# Altium project Capybara.PrjPcb (part 2 of 3)

## Sheet Power.SchDoc
size Letter; SheetNumber: 8; PageSetup: Record=PageOptions|CenterHorizontal=True|CenterVertical=True|PrintScale=0.98|XCorrection=1.00|YCorrection=1.00|PrintKind=0|BorderSize=5000000|LeftOffset=0|BottomOffset=0|Orientation=2|PaperLength=1000|PaperWidth=1000|Scale=100|PaperSource=7|PrintQuality=-3|MediaType=1|DitherType=10|PrintScaleMode=1|PaperKind=Letter|PaperIndex=1
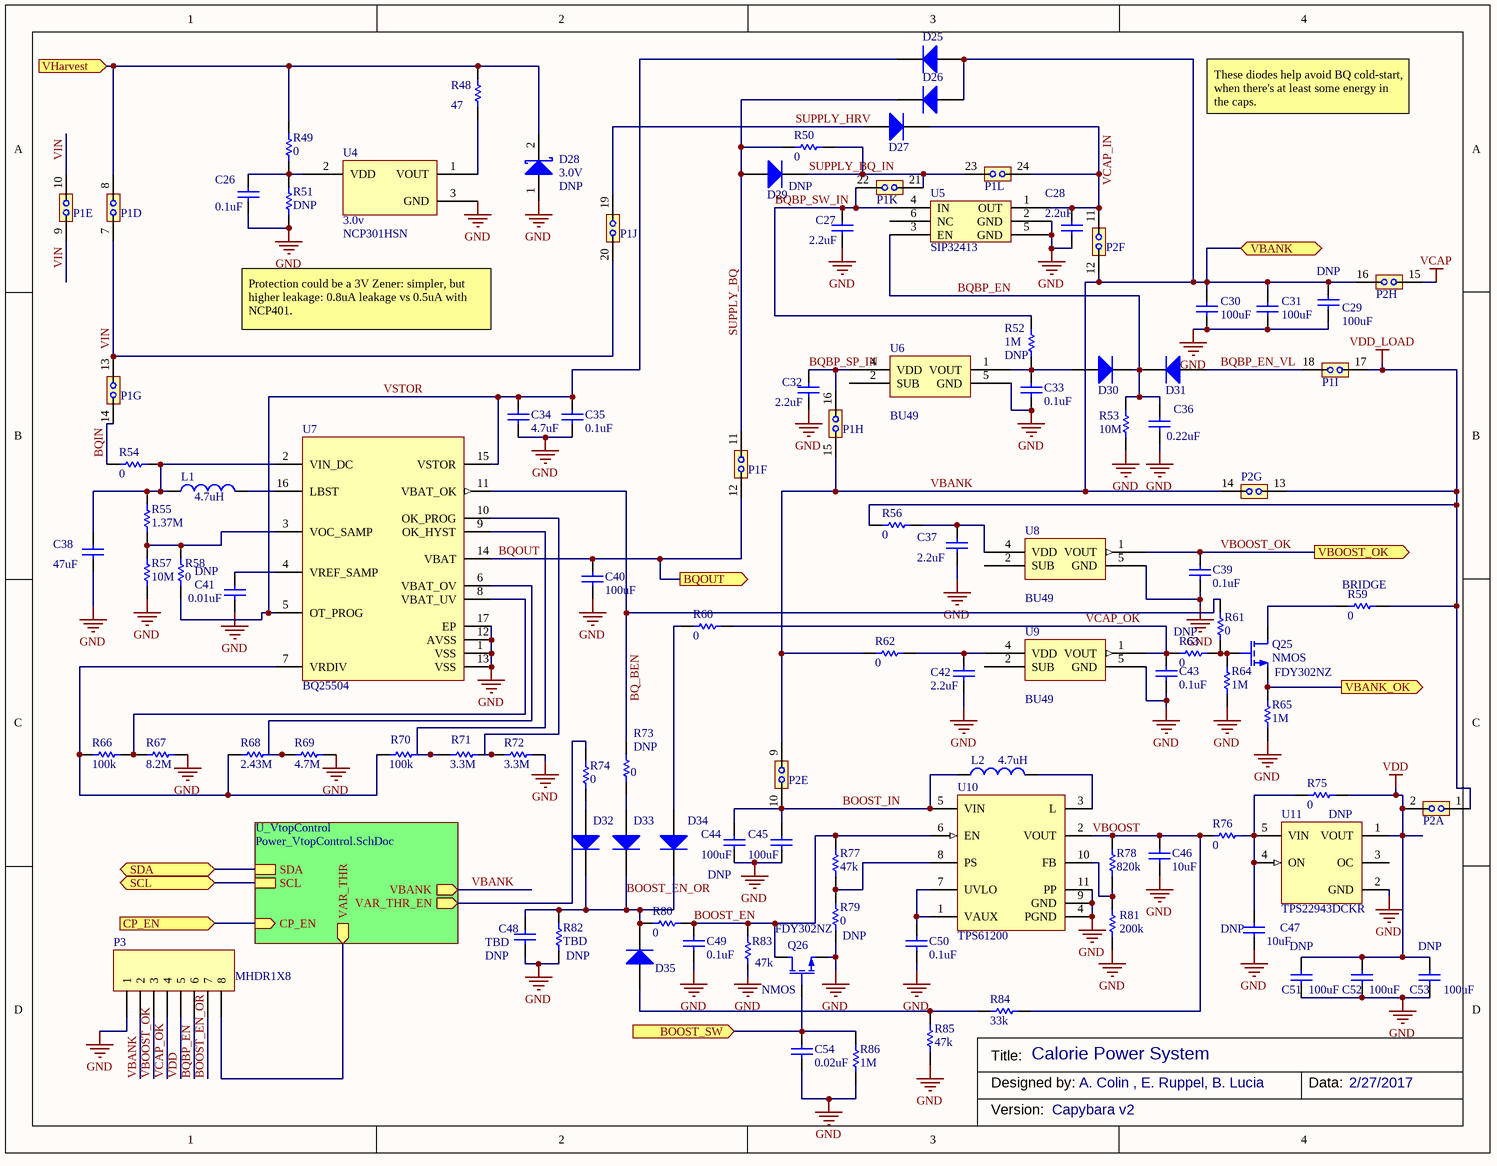
[diagram p6: Power.SchDoc]

### Parts
C26  value 0.1uF  [0603]  (hidden comment: Cap)
C27  value 2.2uF  [0603]  (hidden comment: Cap)
C28  value 2.2uF  [0603]  (hidden comment: Cap)
C29  value 100uF  Note: DNP  [0805]  (hidden comment: Cap)
C30  value 100uF  [0805]  (hidden comment: Cap)
C31  value 100uF  [0805]  (hidden comment: Cap)
C32  value 2.2uF  [0603]  (hidden comment: Cap)
C33  value 0.1uF  [0603]  (hidden comment: Cap)
C34  value 4.7uF  [0603]  (hidden comment: Cap)
C35  value 0.1uF  [0603]  (hidden comment: Cap)
C36  value 0.22uF  [0603]  (hidden comment: Cap)
C37  value 2.2uF  [0603]  (hidden comment: Cap)
C38  value 47uF  [0603]  (hidden comment: Cap)
C39  value 0.1uF  [0603]  (hidden comment: Cap)
C40  value 100uF  [0805]  (hidden comment: Cap)
C41  value 0.01uF  [0603]  (hidden comment: Cap)
C42  value 2.2uF  [0603]  (hidden comment: Cap)
C43  value 0.1uF  [0603]  (hidden comment: Cap)
C44  value 100uF  Note: DNP  [0805]  (hidden comment: Cap)
C45  value 100uF  [0805]  (hidden comment: Cap)
C46  value 10uF  [0603]  (hidden comment: Cap)
C47  value 10uF  Note: DNP  [0805]  (hidden comment: Cap)
C48  value TBD  Note: DNP  [0603]  (hidden comment: Cap)
C49  value 0.1uF  [0603]  (hidden comment: Cap)
C50  value 0.1uF  [0603]  (hidden comment: Cap)
C51  value 100uF  Note: DNP  [0805]  (hidden comment: Cap)
C52  value 100uF  [0805]  (hidden comment: Cap)
C53  value 100uF  Note: DNP  [0805]  (hidden comment: Cap)
C54  value 0.02uF  [0603]  (hidden comment: Cap)
D25  Diode  [SOD-523]  (value not drawn)
D26  Diode  [SOD-523]  (value not drawn)
D27  Diode  [SOD-523]  (value not drawn)
D28  3.0V  Note: DNP  [DIOD-SOD-123-2_V]
D29  Note: DNP  [SOD-523]  (hidden comment: Diode)
D30  Diode  [SOD-523]  (value not drawn)
D31  Diode  [SOD-523]  (value not drawn)
D32  Diode  [SOD-523]  (value not drawn)
D33  Diode  [SOD-523]  (value not drawn)
D34  Diode  [SOD-523]  (value not drawn)
D35  Diode  [SOD-523]  (value not drawn)
L1  value 4.7uH  [PFL1609]
L2  value 4.7uH  [PFL1609]
P1  JMPHDR_12  [MHDR2X12]  (value not drawn)  (parts D,E,F,G,H,I,J,K,L of 12)
P2  JMPHDR_8  (value not drawn)  (parts A,E,F,G,H of 8)
P3  MHDR1X8  [MHDR1X8]
Q25  NMOS  Manufacturer Part Number: FDY302NZ  [SOT-523-3]
Q26  NMOS  Manufacturer Part Number: FDY302NZ  [SOT-523-3]
R48  value 47  [0603]  (hidden comment: Res)
R49  value 0  [0603]  (hidden comment: Res)
R50  value 0  [0603]  (hidden comment: Res)
R51  value DNP  [0603]  (hidden comment: Res)
R52  value 1M  Note: DNP  [0603]  (hidden comment: Res)
R53  value 10M  [0603]  (hidden comment: Res)
R54  value 0  [0603]  (hidden comment: Res)
R55  value 1.37M  [0603]  (hidden comment: Res)
R56  value 0  [0603]  (hidden comment: Res)
R57  value 10M  [0603]  (hidden comment: Res)
R58  value 0  Note: DNP  [0603]  (hidden comment: Resistor)
R59  value 0  Note: BRIDGE  [0603]  (hidden comment: Res)
R60  value 0  [0603]  (hidden comment: Res)
R61  value 0  [0603]  (hidden comment: Res)
R62  value 0  [0603]  (hidden comment: Res)
R63  value 0  Note: DNP  [0603]  (hidden comment: Res)
R64  value 1M  [0603]  (hidden comment: Res)
R65  value 1M  [0603]  (hidden comment: Res)
R66  value 100k  [0603]  (hidden comment: Res)
R67  value 8.2M  [0603]  (hidden comment: Res)
R68  value 2.43M  [0603]  (hidden comment: Res)
R69  value 4.7M  [0603]  (hidden comment: Res)
R70  value 100k  [0603]  (hidden comment: Res)
R71  value 3.3M  [0603]  (hidden comment: Res)
R72  value 3.3M  [0603]  (hidden comment: Res)
R73  value 0  [0603]  (hidden comment: DNP)
R74  value 0  [0603]  (hidden comment: Res)
R75  value 0  [0603]  (hidden comment: Res)
R76  value 0  [0603]  (hidden comment: Res)
R77  value 47k  [0603]  (hidden comment: Res)
R78  value 820k  [0603]  (hidden comment: Res)
R79  value 0  [0603]  (hidden comment: DNP)
R80  value 0  [0603]  (hidden comment: Res)
R81  value 200k  [0603]  (hidden comment: Res)
R82  value TBD  Note: DNP  [0603]  (hidden comment: Res)
R83  value 47k  [0603]  (hidden comment: Res)
R84  value 33k  [0603]  (hidden comment: Res)
R85  value 47k  [0603]  (hidden comment: Res)
R86  value 1M  [0603]  (hidden comment: Res)
U4  value 3.0v  Name: NCP301HSN  [SOT23-5]  (hidden comment: NCP301)
U5  SIP32413  [SC70-6]
U6  Name: BU49  [SOP4]  (hidden comment: BU48)
U7  BQ25504  [VQFN-16]
U8  BU49  [SOP4]
U9  BU49  [SOP4]
U10  TPS61200  [VSON-10]
U11  TPS22943DCKR  Note: DNP  [SC70-5]

### Sub-sheets
U_VtopControl = Power_VtopControl.SchDoc: SDA, SCL, CP_EN (in), VAR_THR_EN (out), VAR_THR (out), VBANK

### Ports
BOOST_SW (in), BQOUT (out), CP_EN (in), SCL, SDA, VBANK, VBANK_OK (out), VBOOST_OK (out), VHarvest (in)

### Nets
GND: C26.1 C27.1 C28.1 C29.1 C30.1 C31.1 C32.1 C33.1 C34.1 C35.1 C36.1 C37.1 C38.2 C39.1 C40.1 C41.1 C42.1 C43.1 C44.1 C45.1 C46.1 C47.1 C48.2 C49.1 C50.1 C51.1 C52.1 C53.1 C54.1 D28.1(A) P3.1 Q26.2(S) R51.1 R53.1 R57.1 R64.1 R65.1 R67.2 R69.2 R72.2 R79.1 R81.1 R82.1 R83.1 R85.1 R86.1 U4.3(GND) U5.2(GND) U5.5(GND) U6.5(GND) U7.1(VSS) U7.12(AVSS) U7.13(VSS) U7.17(EP) U8.5(GND) U9.5(GND) U10.4(PGND) U10.9(GND) U10.11(PP) U11.2(GND)
VCAP: P2.15
VDD: C51.2 C52.2 C53.2 P2.2 P3.5 R75.2 U11.1(VOUT)
VDD_LOAD: P1.17 P2.1 P2.13 R56.2 R59.2
BOOST_EN: C49.2 Q26.3(D) R77.2 R80.2 R83.2 U10.6(EN)
BOOST_EN_OR: C48.1 D32.2(C) D33.2(C) D34.2(C) D35.2(C) P3.7 R80.1 R82.2
BOOST_IN: C44.2 C45.2 L2.1 P2.10 U10.5(VIN)
BOOST_SW: C54.2 Q26.1(G) R86.2 ; port BOOST_SW
BQ_BEN: R61.2 R73.2 U7.11(VBAT_OK)
BQBP_EN: C36.2 D30.2(C) D31.2(C) P3.6 R53.2 U5.3(EN)
BQBP_EN_VL: D31.1(A) P1.18
BQBP_SP_IN: C32.2 P1.16 U6.4(VDD)
BQBP_SW_IN: C27.2 P1.22 R52.2 U5.4(IN)
BQIN: P1.14 R54.1
BQOUT: C40.2 P1.12 U7.14(VBAT) ; port BQOUT
CP_EN: port CP_EN, sheet U_VtopControl/CP_EN
SCL: port SCL, sheet U_VtopControl/SCL
SDA: port SDA, sheet U_VtopControl/SDA
SUPPLY_BQ: D26.2(C) D29.1(A) P1.11 R50.1
SUPPLY_BQ_IN: D29.2(C) P1.21 P1.23 R50.2
SUPPLY_HRV: D27.1(A) P1.19
VAR_THR: P3.8 ; sheet U_VtopControl/VAR_THR
VAR_THR_EN: R74.2 ; sheet U_VtopControl/VAR_THR_EN
VBANK: C29.2 C30.2 C31.2 D25.1(A) D26.1(A) P1.15 P2.9 P2.12 P2.14 P2.16 P3.2 R62.1 ; port VBANK, sheet U_VtopControl/VBANK
VBANK_OK: Q25.2(S) R65.2 ; port VBANK_OK
VBOOST: C46.2 R76.1 R78.2 R84.2 U10.2(VOUT)
VBOOST_OK: C39.2 P3.3 U8.1(VOUT) ; port VBOOST_OK
VCAP_IN: C28.2 D27.2(C) P1.24 P2.11 U5.1(OUT)
VCAP_OK: C43.2 P3.4 R60.2 R63.1 U9.1(VOUT)
VHarvest: D28.2(K) P1.8 R48.1 R49.2 ; port VHarvest
VIN: P1.7 P1.9 P1.10 P1.13 P1.20
VSTOR: C34.2 C35.2 D25.2(C) R58.1 U7.5(OT_PROG) U7.15(VSTOR)
NetC26_2: C26.2 R49.1 R51.2 U4.2(VDD)
NetC33_2: C33.2 D30.1(A) R52.1 U6.1(VOUT)
NetC37_2: C37.2 R56.1 U8.4(VDD)
NetC38_1: C38.1 L1.1 R54.2 R55.2 U7.2(VIN_DC)
NetC41_2: C41.2 U7.4(VREF_SAMP)
NetC42_2: C42.2 R62.2 U9.4(VDD)
NetC47_2: C47.2 R75.1 R76.2 U11.4(ON) U11.5(VIN)
NetC50_2: C50.2 U10.1(VAUX) U10.7(UVLO)
NetD32_1: D32.1(A) R74.1
NetD33_1: D33.1(A) R73.1
NetD34_1: D34.1(A) R60.1
NetD35_1: D35.1(A) R84.1 R85.2
NetL1_2: L1.2 U7.16(LBST)
NetL2_2: L2.2 U10.3(L)
NetQ25_1: Q25.1(G) R61.1 R63.2 R64.2
NetQ25_3: Q25.3(D) R59.1
NetR48_2: R48.2 U4.1(VOUT)
NetR55_1: R55.1 R57.2 R58.2 U7.3(VOC_SAMP)
NetR66_1: R66.1 R68.1 R70.1 U7.7(VRDIV)
NetR66_2: R66.2 R67.1 U7.8(VBAT_UV)
NetR68_2: R68.2 R69.1 U7.6(VBAT_OV)
NetR70_2: R70.2 R71.1 U7.9(OK_HYST)
NetR71_2: R71.2 R72.1 U7.10(OK_PROG)
NetR77_1: R77.1 R79.2 U10.8(PS)
NetR78_1: R78.1 R81.2 U10.10(FB)

Not connected (* = marked no-connect by the designer): U5 6(NC); U6 2(SUB); U8 2(SUB); U9 2(SUB); U11 3(OC)

### Notes on the sheet
- These diodes help avoid BQ cold-start, when there's at least some energy in the caps.
- Protection could be a 3V Zener: simpler, but higher leakage: 0.8uA leakage vs 0.5uA with NCP401.
- Title:
- Designed by:
- (near R84) Calorie Power System
- A. Colin , E. Ruppel, B. Lucia
- Data:
- 2/27/2017
- Version:
- Capybara v2

### Library data of the parts
C26 C33 C35 C39 C43 C49 C50 = Cap: as C115 on sheet CapBank_Introspection; Note: *; Rating: *; Distributor Part Number: 490-1532-1-ND; Distributor: Digi-Key
  C26 C33 C35 C39 C43: Digi-Key Part Number: *
C27 C28 C32 C37 C42 = Cap: as C55 on sheet Sensors; Note: *; Rating: *; Distributor Part Number: 490-3296-1-ND; Distributor: Digi-Key
C29 = Cap: Ceramic Capacitor (Surface Mount); Manufacturer: Murata Electronics North America; Manufacturer Part Number: GRM21BR60J107ME15L; Rating: 6.3V; PurchaseNote: 47uF 587-3266-1-ND; Distributor Part Number: 490-13981-1-ND; Distributor: Digi-Key
C30 C31 = Cap: Ceramic Capacitor (Surface Mount); Manufacturer: Murata Electronics North America; Manufacturer Part Number: GRM21BR60G107ME15L; Rating: 6.3V; PurchaseNote: 47uF 587-3266-1-ND; Distributor: Mouser; Mouser Part Number: 81-GRM21BR60G107ME5L
C34 = Cap: Ceramic Capacitor (Surface Mount); Manufacturer: Samsung Electro-Mechanics; Manufacturer Part Number: CL10B475KQ8NQNC; Digi-Key Part Number: *; Note: *; Rating: *; Distributor Part Number: 1276-2087-1-ND; Distributor: Digi-Key
C36 = Cap: Ceramic Capacitor (Surface Mount); Manufacturer: Murata Electronics North America; Manufacturer Part Number: GRM188R71E224KA88D; Note: *; Rating: *; Distributor Part Number: 490-3290-1-ND; Distributor: Digi-Key
C38 = Cap: Ceramic Capacitor (Surface Mount); Manufacturer: Samsung Electro-Mechanics; Manufacturer Part Number: CL10A476MR8NZNE; Note: *; Distributor Part Number: 1276-6528-1-ND; Distributor: Digi-Key
C40 = Cap: Ceramic Capacitor (Surface Mount); Manufacturer: Murata Electronics North America; Manufacturer Part Number: GRM21BR60G107ME15L; Rating: 6.3V; Digi-Key Part Number: *; Note: *; Distributor: Mouser; Mouser Part Number: 81-GRM21BR60G107ME5L
C41 = Cap: Ceramic Capacitor (Surface Mount); Manufacturer: Murata Electronics North America; Manufacturer Part Number: GRM155R71E103JA01J; Rating: X7R, 10%; Note: *; Distributor Part Number: 490-6340-1-ND; Distributor: Digi-Key
C44 C45 = Cap: Ceramic Capacitor (Surface Mount); Manufacturer: Murata Electronics North America; Manufacturer Part Number: GRM21BR60G107ME15L; PurchaseNote: or CL10A476MR8NZNE 4.0V 0.8mm; Rating: *; Distributor: Mouser; Mouser Part Number: 81-GRM21BR60G107ME5L
  C45: Note: *
C46 = Cap: Ceramic Capacitor (Surface Mount); Manufacturer: Murata Electronics North America; Manufacturer Part Number: GRM188R60J106ME47D; Note: *; Rating: *; Distributor Part Number: 490-3896-1-ND; Distributor: Digi-Key
C47 = Cap: Ceramic Capacitor (Surface Mount); Manufacturer: Murata Electronics North America; Manufacturer Part Number: GRM21BR61E106MA73L; Rating: *; Distributor Part Number: 490-10748-1-ND; Distributor: Digi-Key
C48 = Cap: Ceramic Capacitor (Surface Mount); Manufacturer: Generic Ceramic Chip Cap (TBD); Digi-Key Part Number: *; Manufacturer Part Number: *; Rating: *; Distributor Part Number: *; Distributor: *
C51-C53 = Cap: Ceramic Capacitor (Surface Mount); Manufacturer: Murata Electronics North America; Manufacturer Part Number: GRM21BR60G107ME15L; Rating: *; Distributor: Mouser; Mouser Part Number: 81-GRM21BR60G107ME5L
  C52: Note: *
C54 = Cap: Ceramic Capacitor (Surface Mount); Manufacturer: Samsung Electro-Mechanics; Manufacturer Part Number: CL10B203KB8NNNC; Digi-Key Part Number: *; Note: *; Rating: *; Distributor Part Number: 1276-1984-1-ND; Distributor: Digi-Key
D25-D27 D29-D35 = Diode: General Purpose Diode; Manufacturer: Vishay Semiconductor; Manufacturer Part Number: BAS40-02V-V-G-08; Digi-Key Part Number: BAS40-02V-V-G-08GICT-ND; Value: *; Rating: *; Distributor Part Number: 78-BAS40-02V-V-G-08; Distributor: Mouser; Mouser Part Number: 78-BAS40-02V-V-G-08
  D27 D30-D35: Note: *
D28 = CMP-0303-00003-1: 1.0 A Surface Mount Schottky Barrier Rectifier, 40 V, -65 to 125 degC, 2-Pin SOD-123 Package, RoHS, Tape and Reel; Manufacturer Part Number: MMSZ4683-TP; Manufacturer: Micro Commercial Co; PackageDescription: 2-Pin SOD-123, Body 2.7 x 1.55 mm, Pitch 3.7 mm; PackageReference: SOD-123-2; Digi-Key Part Number: MMSZ4683-TPMSCT-ND
L1 L2 = Inductor: Manufacturer: Coilcraft; Manufacturer Part Number: PFL1609-472MEU; PackageReference: PFL1609; Distributor: Mouser; Distributor Part Number: 994-PFL1609-472MEU
P2 = JMPHDR_8: Manufacturer: Sullins Connector Solutions; Manufacturer Part Number: GRPB082VWVN-RC; Digi-Key Part Number: S9015E-08-ND; Distributor: Digikey; Distributor Part Number: S9015E-08-ND
P3 = MHDR1X8: Header, 8-Pin; Manufacturer: Harwin Inc.; Manufacturer Part Number: M52-5000845; LatestRevisionDate: 17-Jul-2002; LatestRevisionNote: Re-released for DXP Platform.; Publisher: Altium Limited; Digi-Key Part Number: 952-3361-ND; Distributor: Mouser; Distributor Part Number: 855-M52-5000845; Mouser Part Number: 855-M52-5000845
Q25 Q26 = MOSFET-N: N-Channel MOSFET; Manufacturer: Fairchild; Note: *; Rating: *; Value: NMOS; Distributor: Digi-Key; Distributor Part Number: FDY302NZCT-ND
  Q26: Digi-Key Part Number: *
R48 = Res: Chip Resistor (Surface Mount); Manufacturer: Yageo; Manufacturer Part Number: RC0603JR-0747RL; Digi-Key Part Number: *; Rating: *; Note: *; Distributor: Digi-Key; Distributor Part Number: 311-47GRCT-ND
R49 R50 R54 R56 R58-R63 R73-R76 R79 R80 = Res: as R9 on sheet CapBank; Rating: *; Distributor: Digi-Key; Distributor Part Number: 311-0.0GRCT-ND
  R49 R54 R56 R60-R62 R80: Note: *
  R73: Digi-Key Part Number: *; Note: DNP
  R74 R76: Digi-Key Part Number: *; Note: *
  R75: Digi-Key Part Number: *
  R79: Note: DNP
R51 = Res: Chip Resistor (Surface Mount); Manufacturer: Yageo; Digi-Key Part Number: *; Rating: *; Note: *; Distributor: Digi-Key
R52 R64 R65 = Res: Chip Resistor (Surface Mount); Manufacturer: Yageo; Manufacturer Part Number: RC0603FR-071ML; Rating: *; Distributor: Digi-Key; Distributor Part Number: 311-1.00MHRCT-ND
  R52: Digi-Key Part Number: *
  R64 R65: Note: *
R53 R57 R86 = Res: as R89 on sheet Sensors; Rating: *; Distributor: Digi-Key; Distributor Part Number: 311-10MGRCT-ND
  R57: Note: *
  R86: Digi-Key Part Number: *; Note: *
R55 = Res: Chip Resistor (Surface Mount); Manufacturer: Vishay Dale; Manufacturer Part Number: CRCW04021M37FKED; Rating: *; Note: *; Distributor: Digi-Key; Distributor Part Number: 541-1.37MLCT-ND
R66 = Res: Chip Resistor (Surface Mount); Manufacturer: Yageo; Manufacturer Part Number: RT0603FRE07100KL; Rating: 1%; Note: *; Distributor: Digi-Key; Distributor Part Number: YAG2319CT-ND
R67 = Res: Chip Resistor (Surface Mount); Manufacturer: Vishay Dale; Manufacturer Part Number: CRCW06038M20FKEA; Rating: 1%; Note: *; Distributor: Digi-Key; Distributor Part Number: 541-8.20MHCT-ND
R68 = Res: Chip Resistor (Surface Mount); Manufacturer: Vishay; Manufacturer Part Number: CRCW06032M43FKEA; Note: *; Distributor: Mouser; Distributor Part Number: 71-CRCW0603-2.43M-E3; Mouser Part Number: 71-CRCW0603-2.43M-E3
R69 = Res: Chip Resistor (Surface Mount); Manufacturer: Generic Chip Res (TBD); Manufacturer Part Number: RC0603FR-074M7L; Rating: 1%; Note: *; Distributor: Digi-Key; Distributor Part Number: 311-4.70MHRCT-ND
R70 R71 = Res: Chip Resistor (Surface Mount); Manufacturer: Yageo; Manufacturer Part Number: RC0603FR-071M6L; Rating: 1%; Distributor: Digi-Key; Distributor Part Number: YAG3327CT-ND
R72 = Res: Chip Resistor (Surface Mount); Manufacturer: Vishay Dale; Manufacturer Part Number: CRCW06033M30FKEA; Rating: 1%; Distributor: Digi-Key; Distributor Part Number: 541-3.30MHCT-ND
R77 R83 R85 = Res: as R1 on sheet CapBank; Rating: *; Note: *; Distributor: Digi-Key; Distributor Part Number: 311-47KDCT-ND
  R85: Digi-Key Part Number: *
R78 = Res: Chip Resistor (Surface Mount); Manufacturer: Yageo; Manufacturer Part Number: RC0603FR-07820KL; Rating: *; Distributor: Digi-Key; Distributor Part Number: 311-820KHRCT-ND
R81 = Res: Chip Resistor (Surface Mount); Manufacturer: Yageo; Manufacturer Part Number: RC0603FR-07200KL; Rating: *; Note: *; Distributor: Digi-Key; Distributor Part Number: 311-200KHRCT-ND
R82 = Res: as R132 on sheet CapBank; Manufacturer Part Number: *; Digi-Key Part Number: *; Rating: *
R84 = Res: Chip Resistor (Surface Mount); Manufacturer: Yageo; Manufacturer Part Number: RT0603DRE0733KL; Digi-Key Part Number: *; Rating: *; Note: *; Distributor: Digi-Key; Distributor Part Number: 311-2543-1-ND
U4 = NCP301: IC DETECTOR OPEN-DRAIN; Manufacturer: ON Semiconductor; Manufacturer Part Number: NCP301HSN30T1G; Digi-Key Part Number: NCP301HSN30T1GOSCT-ND; Distributor: Mouser; Distributor Part Number: 863-NCP301HSN30T1G; Mouser Part Number: 863-NCP301HSN30T1G
U5 = SIP32431: as U12 on sheet Sensors; Digi-Key Part Number: SIP32431DR3-T1GE3CT-ND; Distributor: Mouser; Distributor Part Number: 781-SIP32431DR3-GE3; Mouser Part Number: 781-SIP32431DR3-GE3
U6 = BU48: IC DETECTOR OPEN-DRAIN; pin to pad: 2>3 4>2 5>4; Manufacturer: ROHM Semiconductor; Manufacturer Part Number: BU4917F-TR; Digi-Key Part Number: BU4917F-TR-ND; Distributor: Quest Components; Distributor Part Number: BU4917F-TR; Mouser Part Number: 755-BU4917F-TR
U7 = BQ25504: Manufacturer: BQ25504RGTT; Manufacturer Part Number: Texas Instruments; Digi-Key Part Number: 296-29741-1-ND; Distributor: Mouser; Distributor Part Number: 595-BQ25504RGTR; Mouser Part Number: 595-BQ25504RGTR
U8 U9 = BU49: IC DETECTOR CMOS; pin to pad: 2>3 4>2 5>4; Manufacturer: ROHM Semiconductor; Manufacturer Part Number: BU4924F-TR; Name: BU49; Digi-Key Part Number: BU4924F-TR-ND; Distributor: Quest Components; Distributor Part Number: BU4924F-TR; Mouser Part Number: 755-BU4924F-TR
U10 = TPS61200: Manufacturer: Texas Instruments; Manufacturer Part Number: TPS61200DRCR; Distributor: Digi-Key; Distributor Part Number: 296-27017-1-ND; Digi-Key Part Number: 296-27017-1-ND; Mouser Part Number: 595-TPS61200DRCR
U11 = CMP-0329-00079-2: Low-Input Voltage 40 mA Current Limited Load Switch, 400 mOhms rDS(On), -40 to 85 degC, 5-pin SC70 (DCK), Green (RoHS & no Sb/Br); Manufacturer: Texas Instruments; SubFamily: Current Limited Switch; Vin(Min)(V): 1.62; Number of FETs: 1; Adjustable Current Limit(Min)(A): 0.04; Enable/Shutdown: Active High; Vin(Max)(V): 5.5; rDS(on) per FET(Typ)(mOhms): 400; Iq(Typ)(uA): 40; PackageReference: DCK0005A; PackageDescription: 5-Pin Plastic Small-Outline Package, 2 x 1.3 mm Body, 0.65 mm Pitch, 2.1 mm Lead Span; DatasheetVersion: SLVS832C; ComponentLink1URL: http://www.ti.com/general/docs/lit/getliterature.tsp?genericPartNumber=TPS22943&fileType=pdf; Mounting Technology: Surface Mount; Code_JEDEC: MO-203-AA; PartNumber: TPS22943DCKR; PackageVersion: revG, Jan-2007; Eco-Plan: Green (RoHS & no Sb/Br); ComponentLink1Description: Datasheet; Distributor: Digi-Key; Distributor Part Number: 296-25316-1-ND; Manufacturer Part Number: TPS22943DCKR; Digi-Key Part Number: 296-25316-1-ND; Mouser Part Number: 595-TPS22943DCKR

## Sheet Power_VtopControl.SchDoc
size A; SheetNumber: 9
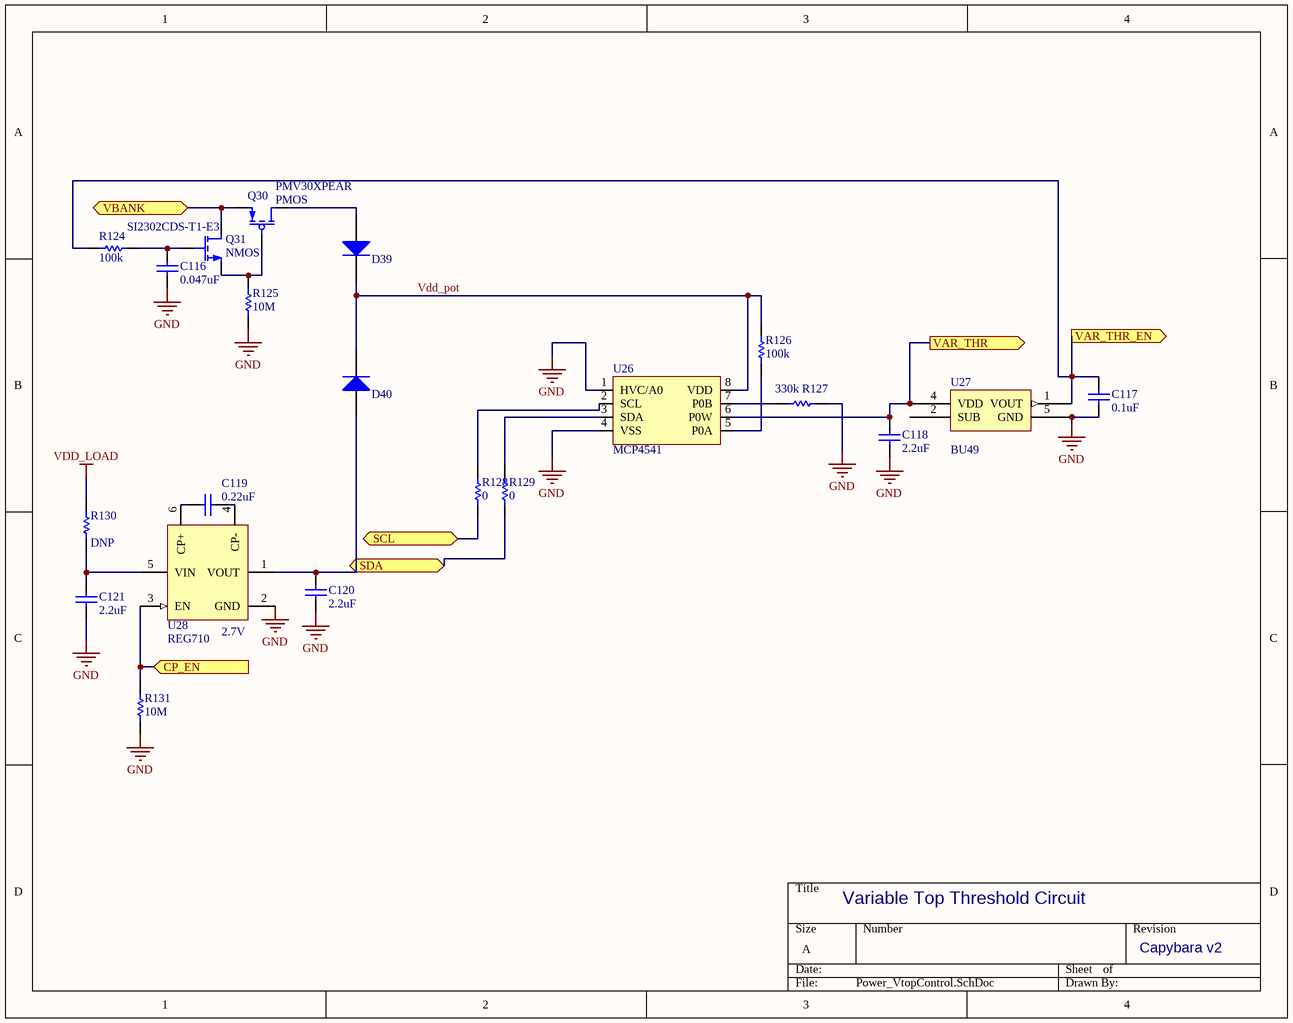
[diagram p7: Power_VtopControl.SchDoc]

### Parts
C116  value 0.047uF  [0603]  (hidden comment: Cap)
C117  value 0.1uF  [0603]  (hidden comment: Cap)
C118  value 2.2uF  [0603]  (hidden comment: Cap)
C119  value 0.22uF  [0603]  (hidden comment: Cap)
C120  value 2.2uF  [0603]  (hidden comment: Cap)
C121  value 2.2uF  [0603]  (hidden comment: Cap)
D39  Diode  [SOD-523]  (value not drawn)
D40  Diode  [SOD-523]  (value not drawn)
Q30  PMOS  Manufacturer Part Number: PMV30XPEAR  [SOT23 - N]
Q31  NMOS  Manufacturer Part Number: SI2302CDS-T1-E3  [SOT23 - N]
R124  value 100k  [0603]  (hidden comment: Res)
R125  value 10M  [0603]  (hidden comment: Res)
R126  value 100k  [0603]  (hidden comment: Res)
R127  value 330k  [0603]  (hidden comment: Resistor)
R128  value 0  [0603]  (hidden comment: Resistor)
R129  value 0  [0603]  (hidden comment: Resistor)
R130  value DNP  [0603]  (hidden comment: Res)
R131  value 10M  [0603]  (hidden comment: Res)
U26  MCP4541  [MSOP8]
U27  BU49  [SOP4]
U28  REG710  value 2.7V  [SOT23-6]

### Ports
CP_EN (in), SCL, SDA, VAR_THR (out), VAR_THR_EN (out), VBANK

### Nets
GND: C116.1 C117.1 C118.1 C120.1 C121.1 R125.1 R127.1 R131.1 U26.1(HVC/A0) U26.4(VSS) U27.5(GND) U28.2(GND)
VDD_LOAD: R130.1
CP_EN: R131.2 U28.3(EN) ; port CP_EN
SCL: R128.1 ; port SCL
SDA: R129.1 ; port SDA
VAR_THR: C118.2 U26.6(P0W) U27.4(VDD) ; port VAR_THR
VAR_THR_EN: C117.2 R124.1 U27.1(VOUT) ; port VAR_THR_EN
VBANK: Q30.2(S) Q31.3(D) ; port VBANK
Vdd_pot: D39.2(C) D40.2(C) R126.2 U26.8(VDD)
NetC116_2: C116.2 Q31.1(G) R124.2
NetC119_1: C119.1 U28.4(CP-)
NetC119_2: C119.2 U28.6(CP+)
NetC120_2: C120.2 D40.1(A) U28.1(VOUT)
NetC121_2: C121.2 R130.2 U28.5(VIN)
NetD39_1: D39.1(A) Q30.3(D)
NetQ30_1: Q30.1(G) Q31.2(S) R125.2
NetR126_1: R126.1 U26.5(P0A)
NetR127_2: R127.2 U26.7(P0B)
NetR128_2: R128.2 U26.2(SCL)
NetR129_2: R129.2 U26.3(SDA)

Not connected (* = marked no-connect by the designer): U27 2(SUB)

### Notes on the sheet
- Variable Top Threshold Circuit
- Capybara v2

### Library data of the parts
C116 = Cap: Ceramic Capacitor (Surface Mount); Manufacturer: Murata Electronics North America; Manufacturer Part Number: GRM188R71H473KA61D; Digi-Key Part Number: *; Note: *; Rating: *; Distributor Part Number: 490-3287-1-ND; Distributor: Digi-Key
C117 = Cap: as C115 on sheet CapBank_Introspection; Digi-Key Part Number: *; Note: *; Rating: *; Distributor Part Number: 490-1532-1-ND; Distributor: Digi-Key
C118 C120 C121 = Cap: as C55 on sheet Sensors; Digi-Key Part Number: *; Note: *; Rating: *; Distributor Part Number: 490-3296-1-ND; Distributor: Digi-Key
C119 = Cap: as C36 on sheet Power; Digi-Key Part Number: *; Note: *; Rating: *; Distributor Part Number: 490-3290-1-ND; Distributor: Digi-Key
D39 D40 = Diode: as D25 on sheet Power; Digi-Key Part Number: BAS40-02V-V-G-08GICT-ND; Value: *; Rating: *; Note: *; Distributor Part Number: 78-BAS40-02V-V-G-08; Distributor: Mouser; Mouser Part Number: 78-BAS40-02V-V-G-08
Q30 = MOSFET-P: P-Channel MOSFET; Manufacturer: Nexperia; Digi-Key Part Number: 1727-2531-1-ND; Note: *; Rating: *; Distributor: Mouser; Distributor Part Number: 771-PMV30XPEAR; Value: PMOS; Mouser Part Number: 771-PMV30XPEAR
Q31 = MOSFET-N: N-Channel MOSFET; Manufacturer: Vishay Siliconix; Digi-Key Part Number: SI2302CDS-T1-E3CT-ND; Note: *; Rating: *; Value: NMOS; Distributor: Mouser; Distributor Part Number: 781-SI2302CDS-E3; Mouser Part Number: 781-SI2302CDS-E3
R124 R126 = Res: as R93 on sheet Sensors; Digi-Key Part Number: *; Rating: *; Distributor: Digi-Key; Distributor Part Number: YAG2319CT-ND
  R124: Note: *
R125 R131 = Res: as R89 on sheet Sensors; Digi-Key Part Number: *; Rating: *; Note: *; Distributor: Digi-Key; Distributor Part Number: 311-10MGRCT-ND
R127 = Res: Chip Resistor (Surface Mount); Manufacturer: Yageo; Manufacturer Part Number: RC0603FR-07330KL; Rating: *; Distributor: Digi-Key; Distributor Part Number: 311-330KHRCT-ND
R128 R129 = Res: as R9 on sheet CapBank; Rating: *; Distributor: Digi-Key; Distributor Part Number: 311-0.0GRCT-ND
R130 = Res: as R132 on sheet CapBank; Manufacturer Part Number: *; Digi-Key Part Number: *; Rating: *
U26 = MCP4541: Manufacturer: Microchip; Manufacturer Part Number: MCP4541T-104E/MS; Digi-Key Part Number: MCP4541-104E/MS-ND; Distributor: Mouser; Distributor Part Number: 579-MCP4541-104E/MS; Mouser Part Number: 579-MCP4541-104E/MS
U27 = BU49: IC DETECTOR CMOS; pin to pad: 2>3 4>2 5>4; Manufacturer: ROHM Semiconductor; Manufacturer Part Number: BU4917F-TR; Name: BU49; Digi-Key Part Number: BU4917F-TR-ND; Distributor: Quest Components; Distributor Part Number: BU4917F-TR; Mouser Part Number: 755-BU4917F-TR
U28 = REG710: Manufacturer: Texas Instruments; Manufacturer Part Number: REG710NA-2.7/250; Digi-Key Part Number: 296-12134-1-ND; Distributor: Mouser; Distributor Part Number: 595-REG710NA-2.7/250; Mouser Part Number: 595-REG710NA-2.7/250

## Sheet Radio.SchDoc
size Letter; SheetNumber: 10
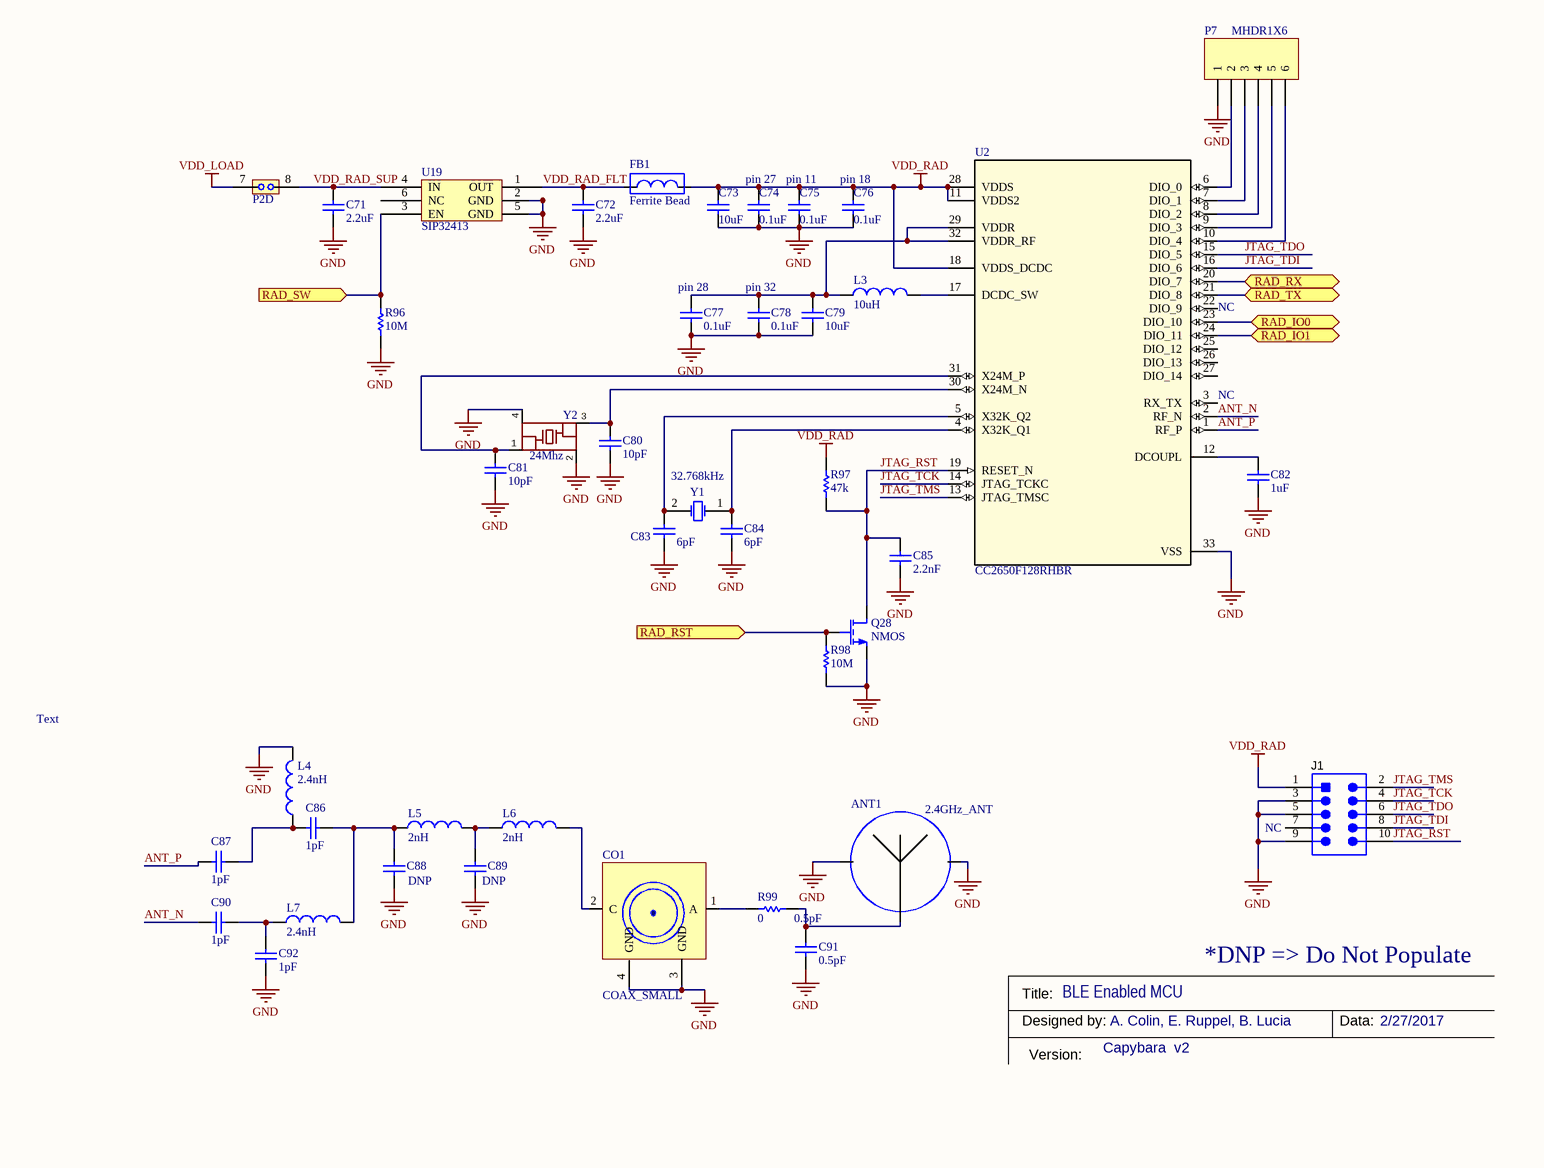
[diagram p8: Radio.SchDoc, bottom left]

### Parts
ANT1  2.4GHz_ANT  [IIF_INV]  (net tie, no BOM)
C71  value 2.2uF  [0603]  (hidden comment: Cap)
C72  value 2.2uF  [0603]  (hidden comment: Cap)
C73  value 10uF  [0603]  (hidden comment: Cap)
C74  value 0.1uF  [0603]  (hidden comment: Cap)
C75  value 0.1uF  [0603]  (hidden comment: Cap)
C76  value 0.1uF  [0603]  (hidden comment: Cap)
C77  value 0.1uF  [0603]  (hidden comment: Cap)
C78  value 0.1uF  [0603]  (hidden comment: Cap)
C79  value 10uF  [0603]  (hidden comment: Cap)
C80  value 10pF  [0402]  (hidden comment: Cap)
C81  value 10pF  [0402]  (hidden comment: Cap)
C82  value 1uF  [0603]  (hidden comment: Cap)
C83  value 6pF  [0402]  (hidden comment: Cap)
C84  value 6pF  [0402]  (hidden comment: Cap)
C85  value 2.2nF  [0603]  (hidden comment: Cap)
C86  value 1pF  [0402]  (hidden comment: Cap)
C87  value 1pF  [0402]  (hidden comment: Cap)
C88  Note: DNP  [0402]  (hidden comment: Cap)
C89  Note: DNP  [0402]  (hidden comment: Cap)
C90  value 1pF  [0402]  (hidden comment: Cap)
C91  value 0.5pF  Note: 0.5pF  [0402]  (hidden comment: Cap)
C92  value 1pF  [0402]  (hidden comment: Cap)
CO1  COAX_SMALL  [COAX SMALL_v2]
FB1  Ferrite Bead  [0603]
J1  (no value)  [JTAG_V3]
L3  value 10uH  [0603]  (hidden comment: Ind)
L4  value 2.4nH  [0402]  (hidden comment: Ind)
L5  value 2nH  [0402]  (hidden comment: Ind)
L6  value 2nH  [0402]  (hidden comment: Ind)
L7  value 2.4nH  [0402]  (hidden comment: Ind)
P2  JMPHDR_8  [MHDR2X8]  (value not drawn)  (part D of 8)
P7  MHDR1X6  [MHDR1X6]
Q28  NMOS  [SOT-523-3]
R96  value 10M  [0603]  (hidden comment: Res)
R97  value 47k  [0603]  (hidden comment: Res)
R98  value 10M  [0603]  (hidden comment: Res)
R99  value 0  [0402]  (hidden comment: Res)
U2  CC2650F128RHBR  [RHB0032E_NV]
U19  SIP32413  [SC70-6]
Y1  value 32.768kHz  [XTAL - 2Pin [3.2mm x 1.5mm]]
Y2  value 24Mhz  [XTAL - 4Pin [2.5mm x 2.0mm]]

### Ports
RAD_IO0 (bidir), RAD_IO1 (bidir), RAD_RST (in), RAD_RX (bidir), RAD_SW (in), RAD_TX (bidir)

### Nets
GND: ANT1.2(GND) ANT1.3(GND) C71.1 C72.1 C73.1 C74.1 C75.1 C76.1 C77.1 C78.1 C79.1 C80.1 C81.2 C82.1 C83.1 C84.1 C85.2 C88.1 C89.1 C91.1 C92.1 CO1.3(GND) CO1.4(GND) J1.3 J1.5 J1.9 L4.2 P7.1 Q28.2(S) R96.1 R98.1 U2.33(VSS) U19.2(GND) U19.5(GND) Y2.2(GROUND2) Y2.4(GROUND4)
VDD_LOAD: P2.7
VDD_RAD: C73.2 C74.2 C75.2 C76.2 FB1.2 J1.1 R97.2 U2.11(VDDS2) U2.18(VDDS_DCDC) U2.28(VDDS)
ANT_N: C90.2 U2.2(RF_N)
ANT_P: C87.2 U2.1(RF_P)
JTAG_RST: C85.1 J1.10 Q28.3(D) R97.1 U2.19(RESET_N)
JTAG_TCK: J1.4 U2.14(JTAG_TCKC)
JTAG_TDI: J1.8 U2.16(DIO_6)
JTAG_TDO: J1.6 U2.15(DIO_5)
JTAG_TMS: J1.2 U2.13(JTAG_TMSC)
RAD_IO0: U2.23(DIO_10) ; port RAD_IO0
RAD_IO1: U2.24(DIO_11) ; port RAD_IO1
RAD_RST: Q28.1(G) R98.2 ; port RAD_RST
RAD_RX: U2.20(DIO_7) ; port RAD_RX
RAD_SW: R96.2 U19.3(EN) ; port RAD_SW
RAD_TX: U2.21(DIO_8) ; port RAD_TX
VDD_RAD_FLT: C72.2 FB1.1 U19.1(OUT)
VDD_RAD_SUP: C71.2 P2.8 U19.4(IN)
NetANT1_1: ANT1.1(ANT) C91.2 R99.2
NetC77_2: C77.2 C78.2 C79.2 L3.1 U2.29(VDDR) U2.32(VDDR_RF)
NetC80_2: C80.2 U2.30(X24M_N) Y2.3(P3)
NetC81_1: C81.1 U2.31(X24M_P) Y2.1(P$1)
NetC82_2: C82.2 U2.12(DCOUPL)
NetC83_2: C83.2 U2.5(X32K_Q2) Y1.2(OSC2)
NetC84_2: C84.2 U2.4(X32K_Q1) Y1.1(OSC1)
NetC86_1: C86.1 C88.2 L5.1 L7.2
NetC86_2: C86.2 C87.1 L4.1
NetC89_2: C89.2 L5.2 L6.1
NetC90_1: C90.1 C92.2 L7.1
NetCO1_1: CO1.1(A) R99.1
NetCO1_2: CO1.2(C) L6.2
NetL3_2: L3.2 U2.17(DCDC_SW)
NetP7_2: P7.2 U2.6(DIO_0)
NetP7_3: P7.3 U2.7(DIO_1)
NetP7_4: P7.4 U2.8(DIO_2)
NetP7_5: P7.5 U2.9(DIO_3)
NetP7_6: P7.6 U2.10(DIO_4)

Not connected (* = marked no-connect by the designer): J1 7; U2 3(RX_TX) 22(DIO_9) 25(DIO_12) 26(DIO_13) 27(DIO_14); U19 6(NC)

### Notes on the sheet
- pin 27
- (near C75) pin 11
- (near C76) pin 18
- (near C77) pin 28
- (near C78) pin 32
- (near U2) NC
- Text
- (near J1) NC
- *DNP => Do Not Populate
- Title:
- Designed by:
- BLE Enabled MCU
- A. Colin, E. Ruppel, B. Lucia
- Data:
- 2/27/2017
- Version:
- Capybara  v2

### Library data of the parts
C71 C72 = Cap: Ceramic Capacitor (Surface Mount); Manufacturer: Murata Electronics North America; Manufacturer Part Number: GRM188R61C225KE15D; Digi-Key Part Number: *; Note: *; Rating: *; Distributor Part Number: 490-3296-1-ND; Distributor: Digi-Key
C73 C79 = Cap: Ceramic Capacitor (Surface Mount); Manufacturer: Murata Electronics North America; Manufacturer Part Number: GRM188R60J106ME47D; Digi-Key Part Number: *; Note: *; Rating: *; Distributor Part Number: 490-3896-1-ND; Distributor: Digi-Key
C74-C78 = Cap: Ceramic Capacitor (Surface Mount); Manufacturer: Murata Electronics North America; Manufacturer Part Number: GRM188R71C104KA01D; Digi-Key Part Number: *; Note: *; Rating: *; Distributor Part Number: 490-1532-1-ND; Distributor: Digi-Key
C80 C81 = Cap: Ceramic Capacitor (Surface Mount); Manufacturer: AvX; Manufacturer Part Number: 04025A100MAT2A; Digi-Key Part Number: *; Note: *; Rating: *; Distributor Part Number: 581-04025A100MAT2A; Distributor: Mouser
C82 = Cap: Ceramic Capacitor (Surface Mount); Manufacturer: Murata Electronics North America; Manufacturer Part Number: GRM188R61A105KA61D; Digi-Key Part Number: *; Note: *; Rating: *; Distributor Part Number: 490-1543-1-ND; Distributor: Digi-Key
C83 C84 = Cap: Ceramic Capacitor (Surface Mount); Manufacturer: Murata Electronics North America; Manufacturer Part Number: GRM1555C1H6R0CA01D; Digi-Key Part Number: *; Rating: *; Distributor Part Number: 490-8222-1-ND; Distributor: Digi-Key
C85 = Cap: Ceramic Capacitor (Surface Mount); Manufacturer: Murata Electronics North America; Manufacturer Part Number: GRM1885C1H222JA01D; Rating: *; Distributor Part Number: 490-1459-1-ND; Distributor: Digi-Key
C86 C87 C90 C92 = Cap: Ceramic Capacitor (Surface Mount); Manufacturer: Murata Electronics; Manufacturer Part Number: GJM1555C1H1R0BB01D; Note: DNP; Digi-Key Part Number: 712-1266-1-ND; Rating: *; Distributor Part Number: 490-6073-1-ND; Distributor: Digi-Key
C88 C89 = Cap: Ceramic Capacitor (Surface Mount); Manufacturer: Generic Ceramic Chip Cap (TBD); Digi-Key Part Number: *; Manufacturer Part Number: *; Rating: *; Distributor Part Number: *; Distributor: *
C91 = Cap: Ceramic Capacitor (Surface Mount); Manufacturer: Murata Electronics; Digi-Key Part Number: *; Manufacturer Part Number: *; Rating: *; Distributor Part Number: 490-6263-1-nd; Distributor: Digikey
CO1 = COAX_SMALL: ms-156hf; Manufacturer: Hirose Connector; Manufacturer Part Number: MS-156HF(20); Distributor: Mouser; Distributor Part Number: 798-MS156HF20; Mouser Part Number: 798-MS156HF20
FB1 = Ferrite Bead: Ferrite bead, RF choke; Manufacturer: Murata Electronics North America; Manufacturer Part Number: BLM18HE152SN1D; Digi-Key Part Number: 490-5216-1-ND; Rating: *; Note: *; Value: *; Distributor: Digikey; Distributor Part Number: 490-5216-1-ND
J1 = GRPB052VWVN-RC: Header, 50mil, 5x2, Gold, TH; Manufacturer: Samtec Inc.; Manufacturer Part Number: FTSH-105-01-L-D-K; U/M: EA; PackageReference: Header, 5x2, 50mil; CompType: Header; RoHS: Y; MountType: TH; ComponentLink1Description: Datasheet Link; Publisher: Texas Instruments; LatestRevisionDate: 2015-08-06; Supplier 1: Digi-Key; ClassName: Header; Distributor: Digikey; Distributor Part Number: SAM8798-ND
L3 = Ind: Inductor (Surface Mount); Manufacturer: Taiyo Yuden; Manufacturer Part Number: LB1608T100M; Alternate Manufacturer: Digikey; Alternate PartNumber: 587-2243-1-ND; Digi-Key Part Number: 587-2243-1-nd; Rating: *; Note: *; Distributor: Mouser; Distributor Part Number: 963-LB1608T100M; Mouser Part Number: 963-LB1608T100M
L4 = Ind: Inductor (Surface Mount); Manufacturer: Murata Electronics North America; Manufacturer Part Number: LQG15HS2N4S02D; Digi-Key Part Number: 490-8389-1-ND; Rating: *; Note: *; Distributor: Digikey; Distributor Part Number: 490-8389-1-ND; Mouser Part Number: LQG15HS2N4S02D
L5 L6 = Ind: Inductor (Surface Mount); Manufacturer: Murata Electronics North America; Manufacturer Part Number: LQG15HS2N0S02D; Digi-Key Part Number: *; Rating: *; Note: *; Distributor: Digikey; Distributor Part Number: 490-6569-1-ND
L7 = Ind: Inductor (Surface Mount); Manufacturer: Murata Electronics North America; Digi-Key Part Number: 490-8389-1-ND; Manufacturer Part Number: Murata Electronics North America; Rating: *; Note: *; Distributor: Digikey; Distributor Part Number: 490-8389-1-ND; Mouser Part Number: LQG15HS2N4S02D
P7 = MHDR1X6: Header, 6-Pin; Manufacturer: Harwin Inc.; Manufacturer Part Number: M52-5000645; LatestRevisionDate: 17-Jul-2002; LatestRevisionNote: Re-released for DXP Platform.; Publisher: Altium Limited; Digi-Key Part Number: 952-3359-ND; Distributor: Digikey; Distributor Part Number: 855-M52-5000645; Mouser Part Number: 855-M52-5000645
Q28 = MOSFET-N: N-Channel MOSFET; Manufacturer Part Number: FDY302NZ; Manufacturer: Fairchild; Note: *; Rating: *; Value: NMOS; Distributor: Digi-Key; Distributor Part Number: FDY302NZCT-ND
R96 R98 = Res: Chip Resistor (Surface Mount); Manufacturer: Yageo; Manufacturer Part Number: RC0603JR-0710ML; Rating: *; Note: *; Distributor: Digi-Key; Distributor Part Number: 311-10MGRCT-ND
  R96: Digi-Key Part Number: *
R97 = Res: Chip Resistor (Surface Mount); Manufacturer: Yageo; Manufacturer Part Number: RT0603DRD0747KL; Rating: *; Note: *; Distributor: Digi-Key; Distributor Part Number: 311-47KDCT-ND
R99 = Res: Chip Resistor (Surface Mount); Manufacturer: Panasonic Electronic Components; Manufacturer Part Number: ERJ-2GE0R00X; Digi-Key Part Number: *; Rating: *; Note: *; Distributor: Digi-Key; Distributor Part Number: P0.0JCT-ND
U2 = CC2650F128RHBR: Imported; Alternate_PartNumber: CC2650F128RHBT; Manufacturer: Texas Instruments; CompType: IC; PIN_COUNT: 33; Application_BuildNumber: *; PartNumber: CC2650F128RHBR; PackageReference: RHB0032E; MountType: SMT; RoHS: Y; RefDes: RefDes; TYPE: TYPE; Digi-Key Part Number: 296-41955-1-ND; Distributor: Mouser; Distributor Part Number: 595-CC2650F128RHBT; Manufacturer Part Number: CC2650F128RHBT; Mouser Part Number: 595-CC2650F128RHBT
U19 = SIP32431: Manufacturer: Vishay Semiconductors; Manufacturer Part Number: SIP32431DR3-T1GE3; Digi-Key Part Number: SIP32431DR3-T1GE3CT-ND; Distributor: Mouser; Distributor Part Number: 781-SIP32431DR3-GE3; Mouser Part Number: 781-SIP32431DR3-GE3
Y1 = XTAL: Crystal Oscillator; Manufacturer: ECS Inc.; Manufacturer Part Number: ECS-.327-6-34QCS-TR; Rating: 6pF; Distributor: Mouser; Distributor Part Number: 520-.327-6-34QCST; Digi-Key Part Number: XC2162CT-ND; Mouser Part Number: 520-.327-6-34QCST
Y2 = ABM11_CERAMIC_SMD_CRYSTALABM11: Manufacturer: ECS Inc.; Manufacturer Part Number: ECS-240-8-36CKM-TR; Rating: 8pF; Distributor: Mouser; Distributor Part Number: 520-ECS-240-8-36CKM; Mouser Part Number: 520-ECS-240-8-36CKM; Digi-Key Part Number: XC1557CT-ND

## Sheet Harvester_Solar.SchDoc
size A; SheetNumber: 6
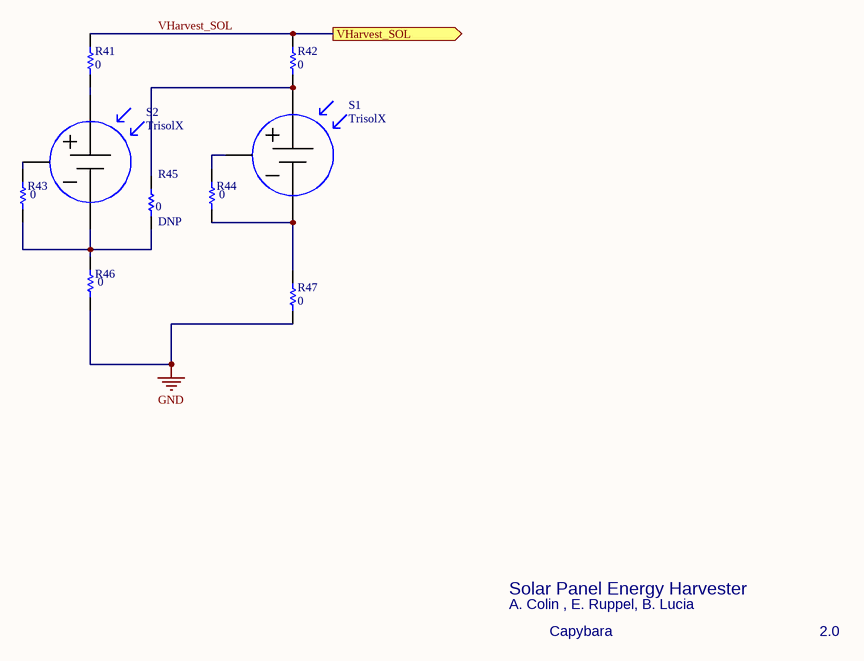
[diagram p9: Harvester_Solar.SchDoc]

### Parts
R41  value 0  [0603]  (hidden comment: Res)
R42  value 0  [0603]  (hidden comment: Res)
R43  value 0  [0603]  (hidden comment: Res)
R44  value 0  [0603]  (hidden comment: Res)
R45  DNP  value 0  [0603]
R46  value 0  [0603]  (hidden comment: Res)
R47  value 0  [0603]  (hidden comment: Res)
S1  TrisolX  [TricoLX - Basic_V3_MIRROR_STRAIGHT_OR_IXYS]
S2  TrisolX  [TricoLX - Basic_V3_MIRROR_STRAIGHT_OR_IXYS]

### Ports
VHarvest_SOL (out)

### Nets
GND: R46.1 R47.1
VHarvest_SOL: R41.2 R42.2 ; port VHarvest_SOL
NetR41_1: R41.1 S2.1(pos)
NetR42_1: R42.1 R45.2 S1.1(pos)
NetR43_1: R43.1 R45.1 R46.2 S2.2(neg)
NetR43_2: R43.2 S2.3(OR)
NetR44_1: R44.1 R47.2 S1.2(neg)
NetR44_2: R44.2 S1.3(OR)

### Notes on the sheet
- Solar Panel Energy Harvester
- A. Colin , E. Ruppel, B. Lucia
- Capybara
- 2.0

### Library data of the parts
R41-R47 = Res: Chip Resistor (Surface Mount); Manufacturer: Yageo; Manufacturer Part Number: RC0603JR-070RL; Rating: *; Note: *; Distributor: Digi-Key; Distributor Part Number: 311-0.0GRCT-ND
S1 S2 = TrisolX_Solar_Wings: TrisolX Solar Wings; Manufacturer: TrisolX; Manufacturer Part Number: TrisolX Solar Wings; Rating: *; Value: *; Note: *; Distributor: *; Distributor Part Number: *; DataSheet: http://www.trisolx.com/wp-content/uploads/2015/03/TrisolX-Solar-Wing-Data-Sheet1.pdf; Digi-Key Part Number: *

## Sheet Harvester_RF.SchDoc
size A; SheetNumber: 5
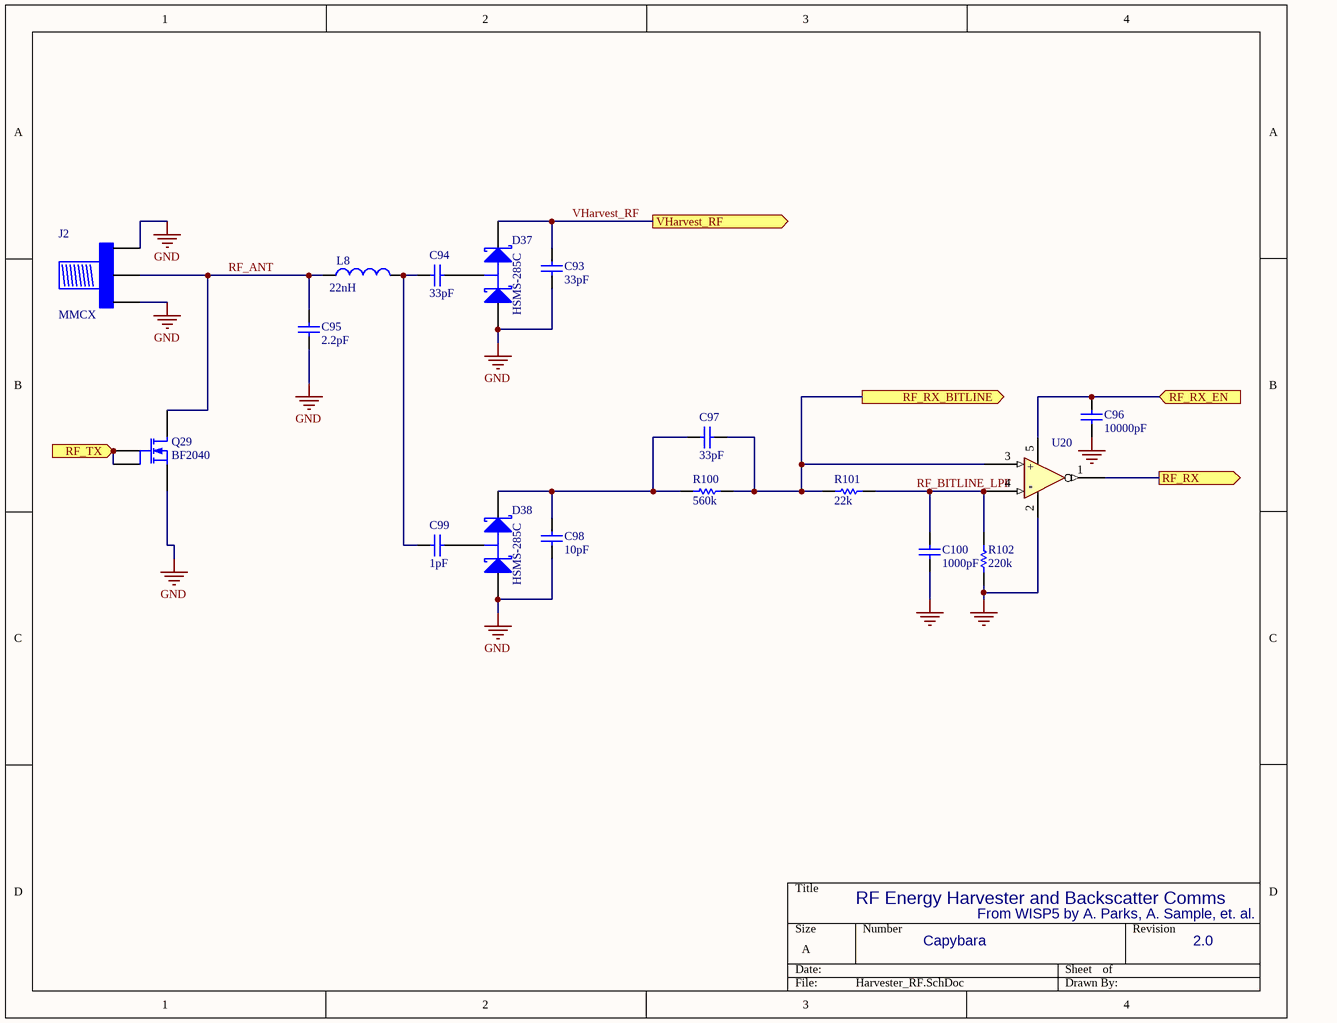
[diagram p10: Harvester_RF.SchDoc]

### Parts
C93  value 33pF  [0402]  (hidden comment: Cap)
C94  value 33pF  [0402]  (hidden comment: Cap)
C95  value 2.2pF  [0402]  (hidden comment: Cap)
C96  value 10000pF  [0402]  (hidden comment: Cap)
C97  value 33pF  [0402]  (hidden comment: Cap)
C98  value 10pF  [0402]  (hidden comment: Cap)
C99  value 1pF  [0402]  (hidden comment: Cap)
C100  value 1000pF  [0402]  (hidden comment: Cap)
D37  HSMS-285C  [SOT-323, HSMS-285C]
D38  HSMS-285C  [SOT-323, HSMS-285C]
J2  MMCX  [MMCX-TH]
L8  value 22nH  [0402]  (hidden comment: Ind)
Q29  BF2040  [SOT-143]
R100  value 560k  [0402]  (hidden comment: Res)
R101  value 22k  [0402]  (hidden comment: Res)
R102  value 220k  [0402]  (hidden comment: Res)
U20  Comparator  [SC70-5]  (value not drawn)

### Ports
RF_RX (out), RF_RX_BITLINE (out), RF_RX_EN (in), RF_TX (in), VHarvest_RF (out)

### Nets
GND: C93.2 C95.1 C96.2 C98.2 C100.2 D37.1(A) D38.1(A) J2.2 Q29.1(S) R102.2 U20.2(Gnd)
RF_ANT: C95.2 J2.1 L8.1 Q29.2(D)
RF_BITLINE_LPF: C100.1 R101.1 R102.1 U20.4(In-)
RF_RX: U20.1(OUT) ; port RF_RX
RF_RX_BITLINE: C97.2 R100.1 R101.2 U20.3(IN+) ; port RF_RX_BITLINE
RF_RX_EN: C96.1 U20.5(VDD) ; port RF_RX_EN
RF_TX: Q29.3(G2) Q29.4(G1) ; port RF_TX
VHarvest_RF: C93.1 D37.2(K) ; port VHarvest_RF
NetC94_1: C94.1 C99.1 L8.2
NetC94_2: C94.2 D37.3(C)
NetC97_1: C97.1 C98.1 D38.2(K) R100.2
NetC99_2: C99.2 D38.3(C)

### Notes on the sheet
- RF Energy Harvester and Backscatter Comms
- Capybara
- From WISP5 by A. Parks, A. Sample, et. al.
- 2.0
- (in symbol NCS2200) +; -

### Library data of the parts
C93 C94 C97 = Cap: Ceramic Capacitor (Surface Mount); Manufacturer: Johanson; Manufacturer Part Number: 500R07S330JV4T; Digi-Key Part Number: 712-1298-1-ND; Note: *; Rating: *; Distributor: Mouser; Distributor Part Number: 609-500R07S330JV4T; Mouser Part Number: 609-500R07S330JV4T
C95 = Cap: Ceramic Capacitor (Surface Mount); Manufacturer: Johanson; Manufacturer Part Number: 500R07S5R6CV4T; Digi-Key Part Number: 712-1289-1-ND; Note: *; Rating: *; Mouser Part Number: 609-500R07S5R6CV4T; Distributor: Mouser; Distributor Part Number: 609-500R07S5R6CV4T
C96 = Cap: as C82 on sheet Radio; Note: *; Rating: *; Distributor: Digi-Key; Distributor Part Number: 490-1543-1-ND
C98 = Cap: Ceramic Capacitor (Surface Mount); Manufacturer: Johanson; Manufacturer Part Number: 500R07S100JV4T; Digi-Key Part Number: 712-1253-1-ND; Note: *; Rating: *; Distributor: Mouser; Distributor Part Number: 609-500R07S100JV4T; Mouser Part Number: 609-500R07S100JV4T
C99 = Cap: Ceramic Capacitor (Surface Mount); Manufacturer: Murata Electronics; Manufacturer Part Number: GJM1555C1H1R0BB01D; Digi-Key Part Number: 712-1266-1-ND; Note: *; Rating: *; Distributor: Digi-Key; Distributor Part Number: 490-6073-1-ND
C100 = Cap: Ceramic Capacitor (Surface Mount); Manufacturer: Generic Ceramic Chip Cap (TBD); Manufacturer Part Number: GRM1555C1H102JA01D; Digi-Key Part Number: 490-3244-1-ND; Note: *; Rating: *; Distributor: Mouser; Distributor Part Number: 81-GRM1555C1H102JA1D; Mouser Part Number: 81-GRM1555C1H102JA1D
D37 D38 = HSMS-285C: Agilent Schottky Diode, Two in Series, Small Package SOT-323; Manufacturer: Avago Technologies US Inc.; Manufacturer Part Number: HSMS-285C-BLKG; Note: *; Digi-Key Part Number: 516-2558-ND; Rating: *; Value: *; Distributor: Mouser; Distributor Part Number: 630-HSMS-285C-BLKG; Mouser Part Number: 630-HSMS-285C-BLKG
J2 = MMCX: MMCX RF Connector; Manufacturer Part Number: 0734151001; Manufacturer: Molex; Note: *; Digi-Key Part Number: WM5552-ND; Distributor: Mouser; Distributor Part Number: 538-73415-1001; Mouser Part Number: 538-73415-1001
L8 = Ind: Inductor (Surface Mount); Manufacturer: Coilcraft (http://www.coilcraft.com/0402cs.cfm); Manufacturer Part Number: 0402CS-22NX_LU; Rating: *; Note: *; Distributor: Mouser; Distributor Part Number: 994-0402CS-22NXGLU; Mouser Part Number: 994-0402CS-22NXGLU
Q29 = BF2040: N-Channel RF MOSFET 1GHz, 40mA; Manufacturer Part Number: BF2040E6814HTSA1; Manufacturer: NXP Semiconductors; Digi-Key Part Number: BF2040E6814HTSA1CT-ND; Rating: *; Value: *; Note: *; Distributor: Mouser; Distributor Part Number: 726-BF2040E6814HTSA1; Mouser Part Number: 726-BF2040E6814HTSA1
R100 = Res: Chip Resistor (Surface Mount); Manufacturer: Panasonic; Manufacturer Part Number: ERJ-2RKF5603X; Digi-Key Part Number: P560KLCT-ND; Rating: *; Note: *; Distributor: Digi-Key; Distributor Part Number: P560KLCT-ND
R101 = Res: Chip Resistor (Surface Mount); Manufacturer: Panasonic; Manufacturer Part Number: ERJ-2RKF2202X; Digi-Key Part Number: P22.0KLCT-ND; Rating: *; Note: *; Distributor: Digi-Key; Distributor Part Number: P22.0KLCT-ND
R102 = Res: Chip Resistor (Surface Mount); Manufacturer: Panasonic; Manufacturer Part Number: ERJ-2RKF2203X; Digi-Key Part Number: P220KLCT-ND; Rating: *; Note: *; Distributor: Digi-Key; Distributor Part Number: P220KLCT-ND
U20 = NCS2200: Comparator: On Semi 10uA Comparator; Manufacturer: ON Semiconductor; Manufacturer Part Number: NCS2200SQ2T2G; Digi-Key Part Number: NCS2200SQ2T2GOSCT-ND; Rating: *; Value: *; Note: *; Distributor: Mouser; Distributor Part Number: 863-NCS2200SQ2T2G; Mouser Part Number: 863-NCS2200SQ2T2G

## Sheet MCU.SchDoc
size A; SheetNumber: 7
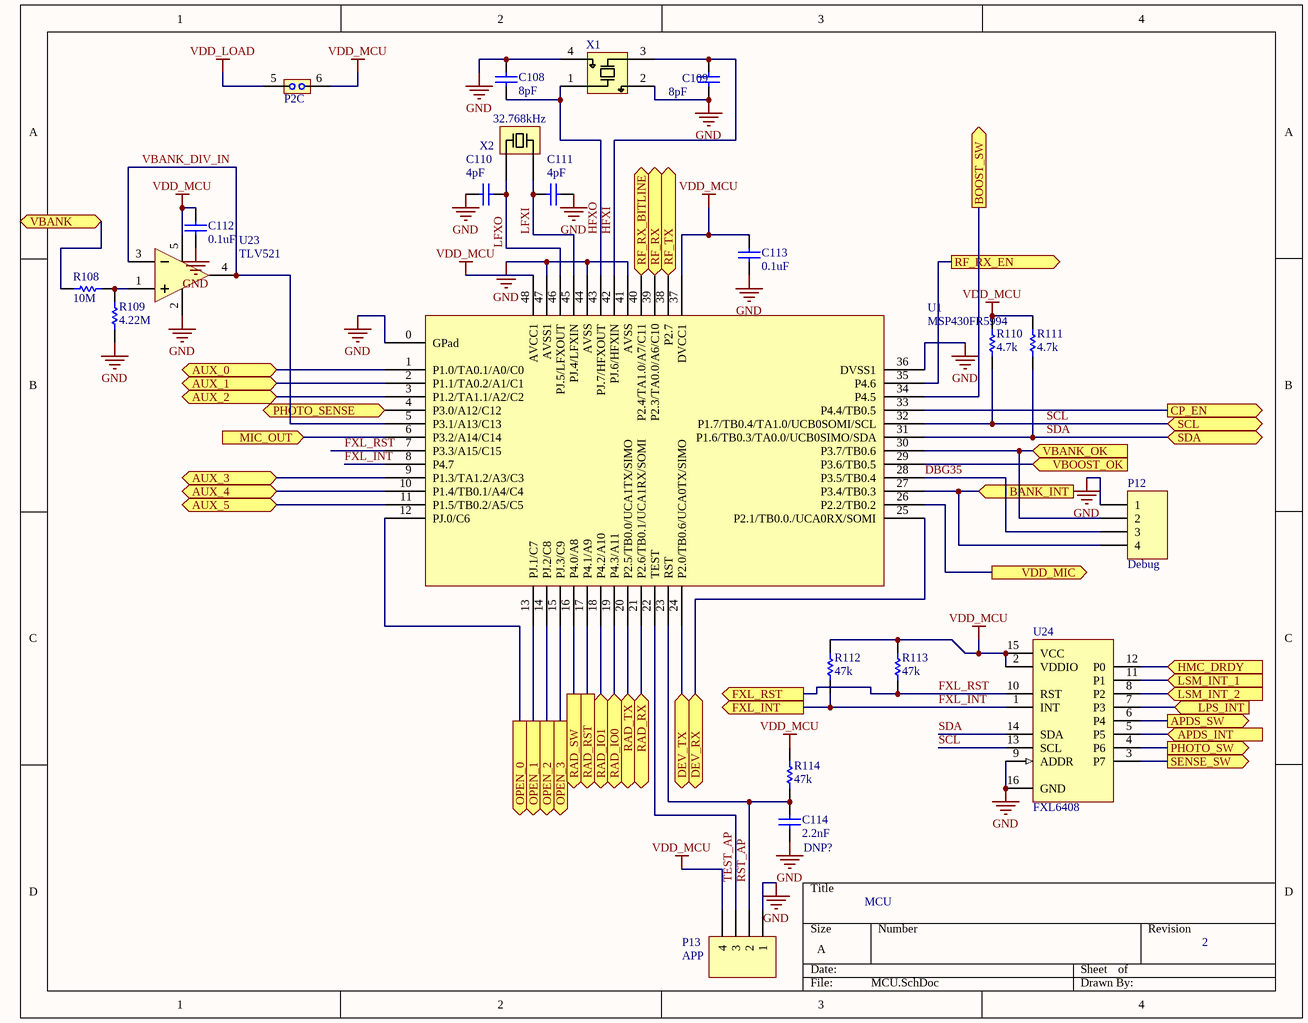
[diagram p11: MCU.SchDoc]

### Parts
C108  value 8pF  [0402]  (hidden comment: Cap)
C109  value 8pF  [0402]  (hidden comment: Cap)
C110  value 4pF  [0402]  (hidden comment: Cap)
C111  value 4pF  [0402]  (hidden comment: Cap)
C112  value 0.1uF  [0603]  (hidden comment: Cap)
C113  value 0.1uF  [0603]  (hidden comment: Cap)
C114  value 2.2nF  Note: DNP?  [0603]  (hidden comment: Cap)
P2  JMPHDR_8  [MHDR2X8]  (value not drawn)  (part C of 8)
P12  Debug  [MHDR1X4]
P13  APP  [MHDR1X4]
R108  value 10M  [0603]  (hidden comment: Res)
R109  value 4.22M  [0603]  (hidden comment: Res)
R110  value 4.7k  [0603]  (hidden comment: Res)
R111  value 4.7k  [0603]  (hidden comment: Res)
R112  value 47k  [0603]  (hidden comment: Res)
R113  value 47k  [0603]  (hidden comment: Res)
R114  value 47k  [0603]  (hidden comment: Res)
U1  MSP430FR5994  [48-QFN - Round Pin 1]
U23  TLV521  [SC70-5]
U24  FXL6408  [16-UMLP]
X1  XTAL 4pin  [XTAL - 4Pin [2.5mm x 2.0mm]]  (value not drawn)
X2  value 32.768kHz  [XTAL - 2Pin [3.2mm x 1.5mm]]  (hidden comment: XTAL)

### Ports
APDS_INT (in), APDS_SW (out), AUX_0, AUX_1, AUX_2, AUX_3, AUX_4, AUX_5, BANK_INT (in), BOOST_SW (out), CP_EN (out), DEV_RX, DEV_TX, FXL_INT (out), FXL_RST (out), HMC_DRDY (in), LPS_INT (in), LSM_INT_1 (in), LSM_INT_2 (in), MIC_OUT (in), OPEN_0 (out), OPEN_1 (out), OPEN_2 (out), OPEN_3 (out), PHOTO_SENSE (in), PHOTO_SW (out), RAD_IO0 (bidir), RAD_IO1 (bidir), RAD_RST (out), RAD_RX (bidir), RAD_SW (out), RAD_TX (bidir), RF_RX (in), RF_RX_BITLINE (in), RF_RX_EN (out), RF_TX (out), SCL (bidir), SDA (bidir), SENSE_SW (out), VBANK, VBANK_OK (in), VBOOST_OK (in), VDD_MIC (out)

### Nets
GND: C108.2 C109.1 C110.1 C111.2 C112.2 C113.2 C114.2 P12.1 P13.1 R109.2 U1.0(GPad) U1.36(DVSS1) U1.41(AVSS) U1.44(AVSS) U1.47(AVSS1) U23.2(IN-) U24.9(ADDR) U24.16(GND) X1.2(Gnd) X1.4(Gnd)
VDD_LOAD: P2.5
VDD_MCU: C112.1 C113.1 P2.6 P13.4 R110.2 R111.2 R112.2 R113.2 R114.2 U1.37(DVCC1) U1.48(AVCC1) U23.5(OS_NUL) U24.2(VDDIO) U24.15(VCC)
APDS_INT: U24.5(P5) ; port APDS_INT
APDS_SW: U24.6(P4) ; port APDS_SW
AUX_0: U1.1(P1.0/TA0.1/A0/C0) ; port AUX_0
AUX_1: U1.2(P1.1/TA0.2/A1/C1) ; port AUX_1
AUX_2: U1.3(P1.2/TA1.1/A2/C2) ; port AUX_2
AUX_3: U1.9(P1.3/TA1.2/A3/C3) ; port AUX_3
AUX_4: U1.10(P1.4/TB0.1/A4/C4) ; port AUX_4
AUX_5: U1.11(P1.5/TB0.2/A5/C5) ; port AUX_5
BANK_INT: P12.4 U1.27(P3.4/TB0.3) ; port BANK_INT
BOOST_SW: U1.34(P4.5) ; port BOOST_SW
CP_EN: U1.33(P4.4/TB0.5) ; port CP_EN
DBG35: P12.3 U1.28(P3.5/TB0.4)
DEV_RX: U1.25(P2.1/TB0.0./UCA0RX/SOMI) ; port DEV_RX
DEV_TX: U1.24(P2.0/TB0.6/UCA0TX/SIMO) ; port DEV_TX
FXL_INT: R112.1 U1.8(P4.7) U24.1(INT) ; port FXL_INT
FXL_RST: R113.1 U1.7(P3.3/A15/C15) U24.10(RST) ; port FXL_RST
HFXI: C109.2 U1.42(PJ.6/HFXIN) X1.3(XOUT)
HFXO: C108.1 U1.43(PJ.7/HFXOUT) X1.1(XIN)
HMC_DRDY: U24.12(P0) ; port HMC_DRDY
LFXI: C111.1 U1.45(PJ.4/LFXIN) X2.1
LFXO: C110.2 U1.46(PJ.5/LFXOUT) X2.2
LPS_INT: U24.7(P3) ; port LPS_INT
LSM_INT_1: U24.11(P1) ; port LSM_INT_1
LSM_INT_2: U24.8(P2) ; port LSM_INT_2
MIC_OUT: U1.6(P3.2/A14/C14) ; port MIC_OUT
OPEN_0: U1.12(PJ.0/C6) ; port OPEN_0
OPEN_1: U1.13(PJ.1/C7) ; port OPEN_1
OPEN_2: U1.14(PJ.2/C8) ; port OPEN_2
OPEN_3: U1.15(PJ.3/C9) ; port OPEN_3
PHOTO_SENSE: U1.4(P3.0/A12/C12) ; port PHOTO_SENSE
PHOTO_SW: U24.4(P6) ; port PHOTO_SW
RAD_IO0: U1.19(P4.3/A11) ; port RAD_IO0
RAD_IO1: U1.18(P4.2/A10) ; port RAD_IO1
RAD_RST: U1.17(P4.1/A9) ; port RAD_RST
RAD_RX: U1.21(P2.6/TB0.1/UCA1RX/SOMI) ; port RAD_RX
RAD_SW: U1.16(P4.0/A8) ; port RAD_SW
RAD_TX: U1.20(P2.5/TB0.0/UCA1TX/SIMO) ; port RAD_TX
RF_RX: U1.39(P2.3/TA0.0/A6/C10) ; port RF_RX
RF_RX_BITLINE: U1.40(P2.4/TA1.0/A7/C11) ; port RF_RX_BITLINE
RF_RX_EN: U1.35(P4.6) ; port RF_RX_EN
RF_TX: U1.38(P2.7) ; port RF_TX
RST_AP: C114.1 P13.2 R114.1 U1.23(RST)
SCL: R110.1 U1.32(P1.7/TB0.4/TA1.0/UCB0SOMI/SCL) U24.13(SCL) ; port SCL
SDA: R111.1 U1.31(P1.6/TB0.3/TA0.0/UCB0SIMO/SDA) U24.14(SDA) ; port SDA
SENSE_SW: U24.3(P7) ; port SENSE_SW
TEST_AP: P13.3 U1.22(TEST)
VBANK: R108.1 ; port VBANK
VBANK_DIV_IN: U1.5(P3.1/A13/C13) U23.3(IN+) U23.4(TAB)
VBANK_OK: P12.2 U1.30(P3.7/TB0.6) ; port VBANK_OK
VBOOST_OK: U1.29(P3.6/TB0.5) ; port VBOOST_OK
VDD_MIC: U1.26(P2.2/TB0.2) ; port VDD_MIC
NetR108_2: R108.2 R109.1 U23.1(OS_NUL)

### Notes on the sheet
- MCU
- 2

### Library data of the parts
C108 C109 = Cap: Ceramic Capacitor (Surface Mount); Manufacturer: Murata Electronics North America; Manufacturer Part Number: GRM1555C1H8R0DA01D; Digi-Key Part Number: *; Note: *; Rating: *; Distributor Part Number: 490-5867-1-ND; Distributor: Digi-Key
C110 C111 = Cap: Ceramic Capacitor (Surface Mount); Manufacturer: Murata Electronics North America; Manufacturer Part Number: GRM1555C1H4R0CA01D; Digi-Key Part Number: *; Note: *; Rating: *; Distributor Part Number: 490-5873-1-ND; Distributor: Digi-Key
C112 C113 = Cap: as C74-C78 on sheet Radio; Note: *; Rating: *; Distributor Part Number: 490-1532-1-ND; Distributor: Digi-Key
C114 = Cap: as C85 on sheet Radio; Rating: *; Distributor Part Number: 490-1459-1-ND; Distributor: Digi-Key
P12 P13 = MHDR1X4: Header, 4-Pin; Manufacturer: Harwin Inc.; Manufacturer Part Number: M52-5000445; LatestRevisionDate: 17-Jul-2002; LatestRevisionNote: Re-released for DXP Platform.; Publisher: Altium Limited; Digi-Key Part Number: 952-3358-ND; Distributor: Mouser; Distributor Part Number: 855-M52-5000445; Mouser Part Number: 855-M52-5000445
R108 = Res: as R96 on sheet Radio; Rating: *; Note: *; Distributor: Digi-Key; Distributor Part Number: 311-10MGRCT-ND
R109 = Res: Chip Resistor (Surface Mount); Manufacturer: Vishay Dale; Manufacturer Part Number: CRCW06034M22FKEA; Rating: *; Note: *; Distributor: Digi-Key; Distributor Part Number: 541-4.22MHCT-ND
R110 R111 = Res: Chip Resistor (Surface Mount); Manufacturer: Yageo; Manufacturer Part Number: RC0402JR-074K7L; Rating: *; Note: *; Distributor: Digi-Key; Distributor Part Number: 311-4.7KJRCT-ND
R112-R114 = Res: as R97 on sheet Radio; Rating: *; Note: *; Distributor: Digi-Key; Distributor Part Number: 311-47KDCT-ND
U1 = MSP430FR5994 48-pin: MSP430 - 48LQFP or 48QFN; Manufacturer: Texas Instruments; Manufacturer Part Number: MSP430FR5994IRGZR; Digi-Key Part Number: 296-45416-1-ND; Rating: *; Value: *; Distributor: Mouser; Distributor Part Number: 595-P430FR5994IRGZR; Note: *; Mouser Part Number: 595-P430FR5994IRGZR
U23 = OPA333, 2333: Low power opamp; pin to pad: 1>3 3>4 4>1; Manufacturer: Texas Instruments; Manufacturer Part Number: TLV521DCKR; Digi-Key Part Number: 296-47441-1-ND; Distributor: Mouser; Distributor Part Number: 595-TLV521DCKR; Note: *; Rating: *; Value: *; Mouser Part Number: 595-TLV521DCKR
U24 = FXL6408: Manufacturer: ON Semiconductor / Fairchild; Manufacturer Part Number: FXL6408UMX; Name: FXL6408; Digi-Key Part Number: FXL6408UMXCT-ND; Distributor: Mouser; Distributor Part Number: 512-FXL6408UMX; Mouser Part Number: 512-FXL6408UMX
X1 = XTAL 4-pins: Crystal - 4-Pin Surface Mount; Manufacturer Part Number: ECS-240-8-36CKM-TR; Manufacturer: ECS Inc.; Rating: 8pF; Value: 24Mhz; Digi-Key Part Number: XC1557CT-ND; Distributor: Mouser; Distributor Part Number: 520-ECS-240-8-36CKM; Mouser Part Number: 520-ECS-240-8-36CKM
X2 = XTAL 2-pins: Crystal - 2-Pin Surface Mount; Manufacturer: ECS Inc.; Manufacturer Part Number: ECS-.327-6-34QCS-TR; Rating: 6pF; Digi-Key Part Number: XC2162CT-ND; Distributor: Mouser; Distributor Part Number: 520-.327-6-34QCST; Mouser Part Number: 520-.327-6-34QCST